# Altium schematic sheet Control_Module_ETH.SchDoc: Módulo de Control - Ethernet
size A4; Author: Martin C.A. Yunis; CompanyName: Sistema de Control de Acceso; Revision: V1; SheetNumber: 2; SheetTotal: 7
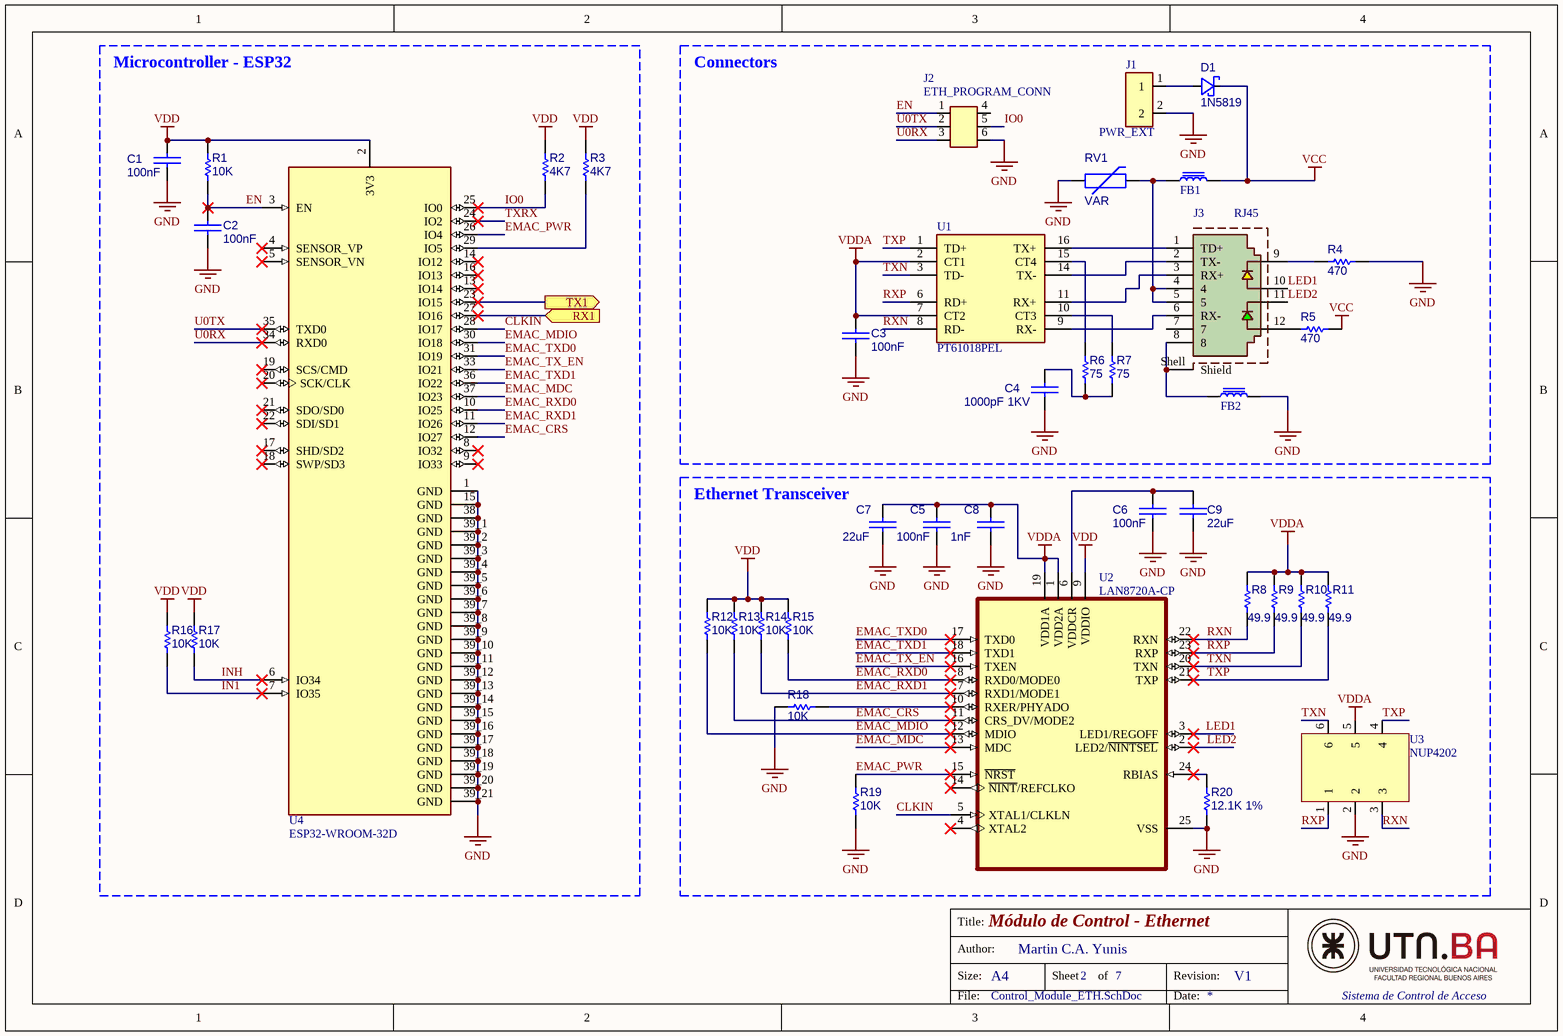
[diagram p0: Control_Module_ETH.SchDoc]

## Parts
C1  100nF  [CAP0402]
C2  100nF  [CAP0402]
C3  100nF  [CAP0402]
C4  1000pF 1KV  [CAP_P1210]
C5  100nF  [CAP0402]
C6  100nF  [CAP0402]
C7  22uF  [CAP_P1210]
C8  1nF  [CAP0402]
C9  22uF  [CAP_P1210]
D1  1N5819  [SOD_123]
FB1  Choke  [CHOKE0603]  (value not drawn)
FB2  Choke  [CHOKE0603]  (value not drawn)
J1  PWR_EXT  [TerminalBlock_1x2_P5mm]
J2  ETH_PROGRAM_CONN  [SAMTEC_MTSW-103-X-X-D-X]
J3  RJ45  [CUI_CRJ061-L1-TH]
R1  10K  [RES0402]
R2  4K7  [RES0402]
R3  4K7  [RES0402]
R4  470  [RES0402]
R5  470  [RES0402]
R6  75  [RES0402]
R7  75  [RES0402]
R8  49.9  [RES0402]
R9  49.9  [RES0402]
R10  49.9  [RES0402]
R11  49.9  [RES0402]
R12  10K  [RES0402]
R13  10K  [RES0402]
R14  10K  [RES0402]
R15  10K  [RES0402]
R16  10K  [RES0402]
R17  10K  [RES0402]
R18  10K  [RES0402]
R19  10K  [RES0402]
R20  12.1K 1%  [RES0402]
RV1  VAR  [RES0805]
U1  PT61018PEL  [XFMR_PT61018PEL]
U2  LAN8720A-CP  [QFN50P400X400X100-25N]
U3  NUP4202  [SOT65P210X110-6N]
U4  ESP32-WROOM-32D  [XCVR_ESP32-WROOM-32U]

## Blocks framed on the sheet
Microcontroller - ESP32: C1 C2 R1-R3 R16 R17 U4
Connectors: C3 C4 D1 FB1 FB2 J1-J3 R4-R7 RV1 U1
Ethernet Transceiver: C5-C9 R8-R15 R18-R20 U2 U3

## Ports
RX1 (in, see Control_Module_MAIN[2B], Control_Module_CPU[1B]), TX1 (out, see Control_Module_MAIN[2A], Control_Module_CPU[1C])

## Nets
GND: C1.2 C2.2 C3.2 C4.2 C5.2 C6.2 C7.2 C8.2 C9.2 FB2.2 J1.2 J2.6 R4.2 R18.1 R19.2 R20.2 RV1.1 U2.25(VSS) U3.2 U4.1(GND) U4.15(GND) U4.38(GND) U4.39_1(GND) U4.39_2(GND) U4.39_3(GND) U4.39_4(GND) U4.39_5(GND) U4.39_6(GND) U4.39_7(GND) U4.39_8(GND) U4.39_9(GND) U4.39_10(GND) U4.39_11(GND) U4.39_12(GND) U4.39_13(GND) U4.39_14(GND) U4.39_15(GND) U4.39_16(GND) U4.39_17(GND) U4.39_18(GND) U4.39_19(GND) U4.39_20(GND) U4.39_21(GND)
VCC: D1.2(K) FB1.2 R5.2
VDD: C1.1 R1.1 R2.1 R3.1 R12.1 R13.1 R14.1 R15.1 R16.1 R17.1 U2.9(VDDIO) U4.2(3V3)
VDDA: C3.1 C5.1 C7.1 C8.1 R8.1 R9.1 R10.1 R11.1 U1.2(CT1) U1.7(CT2) U2.1(VDD2A) U2.19(VDD1A) U3.5
CLKIN: U2.5(XTAL1/CLKLN) U4.28(IO17)
EMAC_CRS: R13.2 U2.11(CRS_DV/MODE2) U4.12(IO27)
EMAC_MDC: U2.13(MDC) U4.37(IO23)
EMAC_MDIO: R12.2 U2.12(MDIO) U4.30(IO18)
EMAC_PWR: R19.1 U2.15(~{NRST}) U4.26(IO4)
EMAC_RXD0: R15.2 U2.8(RXD0/MODE0) U4.10(IO25)
EMAC_RXD1: R14.2 U2.7(RXD1/MODE1) U4.11(IO26)
EMAC_TX_EN: U2.16(TXEN) U4.33(IO21)
EMAC_TXD0: U2.17(TXD0) U4.31(IO19)
EMAC_TXD1: U2.18(TXD1) U4.36(IO22)
EN: C2.1 J2.1 R1.2 U4.3(EN)
IN1: R16.2 U4.7(IO35)
INH: R17.2 U4.6(IO34)
IO0: J2.5 R2.2 U4.25(IO0)
LED1: J3.10 U2.3(LED1/REGOFF)
LED2: J3.11 U2.2(LED2/~{NINTSEL})
RX1: U4.27(IO16) ; port RX1
RXN: R8.2 U1.8(RD-) U2.22(RXN) U3.3
RXP: R9.2 U1.6(RD+) U2.23(RXP) U3.1
TX1: U4.23(IO15) ; port TX1
TXN: R10.2 U1.3(TD-) U2.20(TXN) U3.6
TXP: R11.2 U1.1(TD+) U2.21(TXP) U3.4
TXRX: U4.24(IO2)
U0RX: J2.3 U4.34(RXD0)
U0TX: J2.2 U4.35(TXD0)
NetC4_1: C4.1 R6.2 R7.2
NetC6_1: C6.1 C9.1 U2.6(VDDCR)
NetD1_1: D1.1(A) J1.1
NetFB1_1: FB1.1 J3.4 J3.5 RV1.2
NetFB2_1: FB2.1 J3.8 J3.Shell(Shield)
NetJ3_1: J3.1(TD+) U1.16(TX+)
NetJ3_2: J3.2(TX-) U1.14(TX-)
NetJ3_3: J3.3(RX+) U1.11(RX+)
NetJ3_6: J3.6(RX-) U1.9(RX-)
NetJ3_9: J3.9 R4.1
NetJ3_12: J3.12 R5.1
NetR3_2: R3.2 U4.29(IO5)
NetR6_1: R6.1 U1.15(CT4)
NetR7_1: R7.1 U1.10(CT3)
NetR18_2: R18.2 U2.10(RXER/PHYADO)
NetR20_1: R20.1 U2.24(RBIAS)

Not connected (* = marked no-connect by the designer): J2 4; J3 7; U2 4(XTAL2)* 14(~{NINT}/REFCLKO)*; U4 4(SENSOR_VP)* 5(SENSOR_VN)* 8(IO32)* 9(IO33)* 13(IO14)* 14(IO12)* 16(IO13)* 17(SHD/SD2)* 18(SWP/SD3)* 19(SCS/CMD)* 20(SCK/CLK)* 21(SDO/SD0)* 22(SDI/SD1)*

## Notes on the sheet
- Title:
- Size:
- Author:
- A4
- Sheet
- of
- Revision:
- File:
- Date:

## Library data of the parts
C1-C3 C5 C6 = CAP: Non Polarized Capacitor; MANUF P/N: CL05B104KO5NNNC; JLCPCB P/N: C1525
C4 = CAP: Non Polarized Capacitor; MANUF P/N: C1210X102K102T; JLCPCB P/N: C106100
C7 C9 = CAP: Non Polarized Capacitor; MANUF P/N: CL32A226KOJNNNE; JLCPCB P/N: C19659
C8 = CAP: Non Polarized Capacitor; MANUF P/N: CL05B102KB5NNNC; JLCPCB P/N: C14442
D1 = DIODO_SH: Diode Shottky; MANUF P/N: 1N5819HW-7-F; JLCPCB P/N: C82544
FB1 FB2 = Choke: High Frequency EMI Suppression Ferrite Bead; Manufacturer Part Number: 742863160; Manufacturer: Wurth Elektronik; Match Code: WE-CBF HF; Case/Size Code: 0603; DC Resistance: 0.22Ohm; Impedance @100MHz: 600Ohm; Impedance @1GHz: 800Ohm; Impedance Max: 950Ohm; Impedance Max Test Condition: 600MHz; Rated Current: 0.5A; Type: High Current; Category: Ferrites for PCB Assembly; ComponentLink1Description: Website Link; ComponentLink1URL: https://www.we-online.com/redexpert/article/742863160?ad; ComponentLink2Description: Datasheet Link; ComponentLink2URL: https://www.we-online.com/redexpert/spec/742863160?ad; Mount: Surface Mount; Operating Temperature Max: 125°C; Operating Temperature Min: -55°C; Packaging: Tape and Reel; Length: 1.6mm; Width: 0.8mm; Height: 0.8mm
J1 = CONN_2P: 12V EXT Connector; MANUF P/N: WJ2EDGRC-5.08-2P; JLCPCB P/N: C3697; JLCPCB P/N 2: C8414
J2 = CONN_3X2P: ESP Programming Connector; MANUF P/N: 2.54-2*3PPin; JLCPCB P/N: C65114
J3 = CRJ061-L1-TH: 8P8C, Single Port, Vertical, Shielded, LED, Through Hole, RJ45 Modular Connector; MF: Same Sky; SnapEDA_Link: https://www.snapeda.com/parts/CRJ061-L1-TH/Same+Sky/view-part/?ref=snap; Package: None; Value: *; MP: CRJ061-L1-TH; Check_prices: https://www.snapeda.com/parts/CRJ061-L1-TH/Same+Sky/view-part/?ref=eda; MANUF P/N: CRJ061-L1-TH; JLCPCB P/N: C3179438
R1 R12-R19 = Res1: Resistor; MANUF P/N: CRCW040210K0FKED; JLCPCB P/N: C71617
R2 R3 = Res1: Resistor; MANUF P/N: CR0402FF4701G; JLCPCB P/N: C100444
R4 R5 = Res1: Resistor; MANUF P/N: CR0402FF4700G; JLCPCB P/N: C100443
R6 R7 = Res1: Resistor; MANUF P/N: CR0402JF0750G; JLCPCB P/N: C100685
R8-R11 = Res1: Resistor; MANUF P/N: RMC040249.91%N; JLCPCB P/N: C325388
R20 = Res1: Resistor; MANUF P/N: 0402WGF1212TCE; JLCPCB P/N: C25852
RV1 = VAR: Varistor; MANUF P/N: AVR-M2012C220KT6AB; JLCPCB P/N: C432914
U1 = PT61018PEL: LAN Transformer, 10/100 Base-Tx, OP -40C to +85C, CUT TAPE | Bourns PT61018PEL; SnapEDA_Link: https://www.snapeda.com/parts/PT61018PEL/Bourns/view-part/?ref=snap; Package: SMD-16 Bourns; Value: *; MF: Bourns; MP: PT61018PEL; Check_prices: https://www.snapeda.com/parts/PT61018PEL/Bourns/view-part/?ref=eda; MANUF P/N: PT61018PEL; JLCPCB P/N: C840586
U2 = LAN8720A-CP: PHY 1-CH 10Mbps/100Mbps 2.5V/3.3V 24-Pin VQFN EP Tray; MF: Microchip Technology; SnapEDA_Link: https://www.snapeda.com/parts/LAN8720A-CP/Microchip/view-part/?ref=snap; Package: VFQFN-24 Microchip Technology; Value: *; MP: LAN8720A-CP; Check_prices: https://www.snapeda.com/parts/LAN8720A-CP/Microchip/view-part/?ref=eda; MANUF P/N: LAN8720A-CP; JLCPCB P/N: C633280
U3 = NUP4202: 6A 20V 6V Unidirectional 5V SOT-363 ESD and Surge Protection; MANUF P/N: NUP4202W1; JLCPCB P/N: C252434
U4 = ESP32-WROOM-32D: Bluetooth, WiFi 802.11b/g/n, Bluetooth v4.2 +EDR, Class 1, 2 and 3 Transceiver Module 2.4GHz ~ 2.5GHz Integrated; MANUF P/N: ESP32-WROOM-32U-N4; MF: Espressif Systems; SnapEDA_Link: https://www.snapeda.com/parts/ESP32-WROOM-32D/Espressif+Systems/view-part/?ref=snap; Package: Non Standard Espressif Systems; Value: *; MP: ESP32-WROOM-32D; Check_prices: https://www.snapeda.com/parts/ESP32-WROOM-32D/Espressif+Systems/view-part/?ref=eda; JLCPCB P/N: C328062